# Altium schematic sheet COMMOM.SchDoc
size A4; SheetNumber: 3; SheetTotal: 3
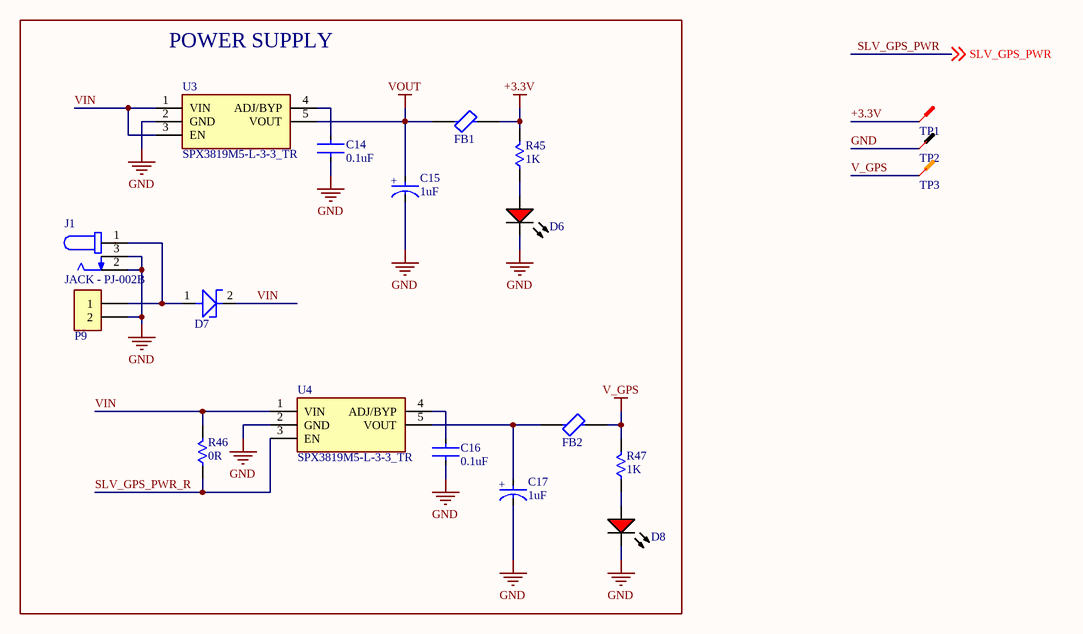
[diagram p0: COMMOM.SchDoc]

## Parts
C14  0.1uF  [0805-CAP]
C15  1uF  [1206-CAP-TANT]
C16  0.1uF  [0805-CAP]
C17  1uF  [1206-CAP-TANT]
D6  RED  [0805-LED-RED]  (value not drawn)
D7  NRVB120VLSFT1G  [SOD-123]  (value not drawn)
D8  RED  [0805-LED-RED]  (value not drawn)
FB1  BLM21BB121SN1D  [0805-IND]  (value not drawn)
FB2  BLM21BB121SN1D  [0805-IND]  (value not drawn)
J1  JACK - PJ-002B  [JACK - CUI_PJ-002B]
P9  691312510002  [691312510002]  (value not drawn)
R45  1K  [0805-RES]
R46  0R  [0805-RES]
R47  1K  [0805-RES]
TP1  .Net  [TESTPOINT_MINI_RED]  (value not drawn)
TP2  .Net  [TESTPOINT_MINI_BLACK]  (value not drawn)
TP3  5003  [TESTPOINT_MINI_ORANGE]  (value not drawn)
U3  SPX3819M5-L-3-3_TR  [SPX3819M5-L-3-3_TR]
U4  SPX3819M5-L-3-3_TR  [SPX3819M5-L-3-3_TR]

## Blocks framed on the sheet
POWER SUPPLY: C14-C17 D6-D8 FB1 FB2 J1 P9 R45-R47 U3 U4

## Nets
+3.3V: FB1.2 R45.2 TP1.1
GND: C14.2 C15.2(C) C16.2 C17.2(C) D6.2(K) D8.2(K) J1.2 J1.3 P9.2 TP2.1 U3.2(GND) U4.2(GND)
V_GPS: FB2.2 R47.2 TP3.1
VOUT: C15.1(A) FB1.1 U3.5(VOUT)
SLV_GPS_PWR_R: R46.1 U4.3(EN)
VIN: D7.2 R46.2 U3.1(VIN) U3.3(EN) U4.1(VIN)
NetC14_1: C14.1 U3.4(ADJ/BYP)
NetC16_1: C16.1 U4.4(ADJ/BYP)
NetC17_1: C17.1(A) FB2.1 U4.5(VOUT)
NetD6_1: D6.1(A) R45.1
NetD7_1: D7.1 J1.1 P9.1
NetD8_1: D8.1(A) R47.1

## Notes on the sheet
- Title:
- Author:
- Sheet:
- Date:
- Revision:
- /
- (in symbol TAJA105K020RNJ) +

## Library data of the parts
C14 C16 = AC0805KRX7R7BB104: CAP CER SMD 0805, 0.1uF / 16V, ±10%; Manufacturer: Yageo; Value: 100nF; Supplier 1: Mouser; Manufacturer Part Number: AC0805KRX7R7BB104; RoHS: Yes; Category: Ceramic Capacitors; Stock 1: 118257; Pricing 1: 1=0,19, 10=0,079, 50=0,079, 100=0,046, 1000=0,041, 10000=0,028 (USD); Case/Package: 0805; Case Code (Imperial): 0805; Case Code (Metric): 2012; Min Operating Temperature: -55°C; Max Operating Temperature: 125°C; Tolerance: 10%; Voltage Rating: 16V; Packaging: Cut Tape; Series: AC; Ratings: AEC-Q200; RoHS Compliant: Yes; ComponentLink1URL: http://www.yageo.com/NewPortal/_en/search/productDocs.jsp?YageoPartNumber=AC0805KRX7R7BB104&src-supplier=Digi-Key; ComponentLink1Description: http://www.yageo.com/NewPortal/_en/search/productDocs.jsp?YageoPartNumber=AC0805KRX7R7BB104&src-supplier=Digi-Key; Supplier Part Number 1: 603-AC805KRX7R7BB104; Mounting Technology: Surface Mount; Supplier 2: Digi-Key; Supplier 3: Digi-Key; Supplier Part Number 2: 311-3162-1-ND; Supplier Part Number 3: 311-3162-6-ND
C15 C17 = TAJA105K020RNJ: CAP TANT SMD 1206, 1uF / 20V, ±10%; Manufacturer: Kyocera AVX; Dielectric Material: Tantalum; Tolerance: 20%; ESR (Equivalent Series Resistance): 9R; Leakage Current: 500nA; Polarity: Polar; Dissipation Factor: 4%; Supplier 1: Mouser; Manufacturer Part Number: TAJA105K020RNJ; RoHS: Yes; Category: Tantalum Capacitors; Stock 1: 2000; Pricing 1: 2000=0,09520 (USD); Mount: Surface Mount,PCB; Case/Package: 1206; Number of Pins: 2; Case Code (Imperial): 1206; Case Code (Metric): 3216; Min Operating Temperature: -55°C; Max Operating Temperature: 125°C; Capacitance: 1uF; Voltage Rating: 20V; Voltage Rating (DC): 20V; Package Quantity: 1; Packaging: Tape and Reel; Termination: SMD/SMT; Voltage: 20V; Features: General Purpose; Series: TAJ; Construction: Flat; Length: 3.2mm; Width: 1.6mm; Height: 1.6mm; Height - Seated (Max): 0.071inch; Depth: 1.6mm; Radiation Hardening: No; REACH SVHC: No SVHC; Lead Free: Lead Free; RoHS Compliant: Yes; ComponentLink1URL: https://datasheet.ciiva.com/11794/0900766b80ccdc61-11794382.pdf?src-supplier=RSComponents; ComponentLink1Description: https://datasheet.ciiva.com/11794/0900766b80ccdc61-11794382.pdf?src-supplier=RSComponents; ComponentLink2URL: https://datasheet.ciiva.com/12883/taj-27497-12883280.pdf?src-supplier=Mouser; ComponentLink2Description: https://datasheet.ciiva.com/12883/taj-27497-12883280.pdf?src-supplier=Mouser; ComponentLink3URL: https://datasheet.ciiva.com/263/taj-263413.pdf?src-supplier=Digi-Key; ComponentLink3Description: https://datasheet.ciiva.com/263/taj-263413.pdf?src-supplier=Digi-Key; ComponentLink4URL: https://datasheet.ciiva.com/263/taj-263412.pdf?src-supplier=Digi-Key; ComponentLink4Description: https://datasheet.ciiva.com/263/taj-263412.pdf?src-supplier=Digi-Key; ComponentLink5URL: https://datasheet.ciiva.com/263/taj-263414.pdf?src-supplier=Digi-Key; ComponentLink5Description: https://datasheet.ciiva.com/263/taj-263414.pdf?src-supplier=Digi-Key; ComponentLink6URL: https://datasheet.ciiva.com/14608/70001050-14608053.pdf?src-supplier=Allied+Electronics; ComponentLink6Description: https://datasheet.ciiva.com/14608/70001050-14608053.pdf?src-supplier=Allied+Electronics; ComponentLink7URL: https://datasheet.ciiva.com/14598/70001050-14598921.pdf?src-supplier=Allied+Electronics; ComponentLink7Description: https://datasheet.ciiva.com/14598/70001050-14598921.pdf?src-supplier=Allied+Electronics; ComponentLink8URL: https://datasheet.ciiva.com/3004/taj-3004373.pdf?src-supplier=Avnet; ComponentLink8Description: https://datasheet.ciiva.com/3004/taj-3004373.pdf?src-supplier=Avnet; ComponentLink9URL: https://datasheet.ciiva.com/16203/taj-16203563.pdf?src-supplier=Future+Electronics; ComponentLink9Description: https://datasheet.ciiva.com/16203/taj-16203563.pdf?src-supplier=Future+Electronics; ComponentLink10URL: https://datasheet.ciiva.com/3004/taj-3004372.pdf?src-supplier=Avnet; ComponentLink10Description: https://datasheet.ciiva.com/3004/taj-3004372.pdf?src-supplier=Avnet; Supplier Part Number 1: 581-TAJA105K020; Supplier 2: Digi-Key; Supplier Part Number 2: 478-1650-1-ND; Supplier 3: Digi-Key; Supplier Part Number 3: 478-1650-6-ND
D6 D8 = LTST-C170EKT: LED RED, SMD 0805, 2V/30mA; Manufacturer: Vishay Lite-On; Lens Color: Colorless; Power Rating: 100mW; Luminous Intensity: 2mcd; Viewing Angle: 130°; Forward Voltage: 2V; Lens Style: Flat,Diffused,Colorless,Rectangular,Clear; Forward Current: 30mA; Dominant Wavelength: 621nm; Test Current: 10mA; Lens Transparency: Clear; Number of Elements: 1; Wavelength: 630nm; Reverse Voltage: 5V; Lens Size: 1.25mm; Supplier 1: Mouser; Manufacturer Part Number: LTST-C170EKT; RoHS: Yes; Category: LEDs; Stock 1: 36000; Pricing 1: 3000=0,0571, 6000=0,0465, 15000=0,0404, 30000=0,035, 75000=0,0347, 150000=0,0331 (USD); Case/Package: 0805; Color: Red; Case Code (Metric): 2012; Case Code (Imperial): 0805; Min Operating Temperature: -55°C; Max Operating Temperature: 85°C; Packaging: Tape and Reel; Package Quantity: 3000; Illumination Color: Red; Power Dissipation: 100mW; Number of LEDs: 1; Length: 2mm; Width: 1.25mm; Height: 1.1mm; Depth: 1.25mm; Radiation Hardening: No; Lead Free: Lead Free; RoHS Compliant: Yes; ComponentLink1URL: https://datasheet.ciiva.com/16202/lite-on20ltst-c170ekt-16202383.pdf?src-supplier=Future+Electronics; ComponentLink1Description: https://datasheet.ciiva.com/16202/lite-on20ltst-c170ekt-16202383.pdf?src-supplier=Future+Electronics; ComponentLink2URL: https://datasheet.ciiva.com/2110/ltst-c170ekt-2110099.pdf?src-supplier=Digi-Key; ComponentLink2Description: https://datasheet.ciiva.com/2110/ltst-c170ekt-2110099.pdf?src-supplier=Digi-Key; ComponentLink3URL: https://datasheet.ciiva.com/11775/0900766b80dc0277-11775641.pdf?src-supplier=Rs; ComponentLink3Description: https://datasheet.ciiva.com/11775/0900766b80dc0277-11775641.pdf?src-supplier=Rs; ComponentLink4URL: https://datasheet.ciiva.com/19482/1260314-19482330.pdf?src-supplier=Jameco; ComponentLink4Description: https://datasheet.ciiva.com/19482/1260314-19482330.pdf?src-supplier=Jameco; ComponentLink5URL: https://datasheet.ciiva.com/15117/getdatasheetpartid-147507-15117859.pdf?src-supplier=Verical; ComponentLink5Description: https://datasheet.ciiva.com/15117/getdatasheetpartid-147507-15117859.pdf?src-supplier=Verical; ComponentLink6URL: https://datasheet.ciiva.com/2110/ltst-c170ekt-2110100.pdf?src-supplier=Digi-Key; ComponentLink6Description: https://datasheet.ciiva.com/2110/ltst-c170ekt-2110100.pdf?src-supplier=Digi-Key; ComponentLink7URL: https://datasheet.ciiva.com/2110/ltst-c170ekt-2110101.pdf?src-supplier=Digi-Key; ComponentLink7Description: https://datasheet.ciiva.com/2110/ltst-c170ekt-2110101.pdf?src-supplier=Digi-Key; Supplier Part Number 1: 859-LTST-C170EKT; Mounting Technology: Surface Mount; Pins: 2; Series: -; Voltage: 5V; Supplier 2: Digi-Key; Supplier Part Number 2: 160-1178-1-ND; Supplier 3: Digi-Key; Supplier Part Number 3: 160-1178-6-ND
D7 = NRVB120VLSFT1G: DIODE SHOTTKY SMD SOD-123F, 0,3V/1A, VBR 20V; Manufacturer: ON Semiconductor; Average Rectified Current: 1A; Max Reverse Current: 15mA; Peak Non-Repetitive Surge Current: 45A; Element Configuration: Single; Supplier 2: Digi-Key; Manufacturer Part Number: NRVB120VLSFT1G; RoHS: Yes; Category: Schottky Diodes; Stock 1: 170; Pricing 1: 1=0,51000, 5=0,51000, 10=0,43400, 25=0,39700, 50=0,36100, 100=0,32400, 250=0,28900, 500=0,25400, 1000=0,19700 (USD); Mount: Surface Mount; Case/Package: SOD; Number of Pins: 2; Min Operating Temperature: -65°C; Max Operating Temperature: 125°C; Packaging: Tape and Reel; Max Repetitive Reverse Voltage (Vrrm): 20V; Max Reverse Voltage (DC): 20V; Lead Free: Lead Free; RoHS Compliant: Yes; ComponentLink1URL: http://www.farnell.com/datasheets/2028665.pdf?src-supplier=Farnell; ComponentLink1Description: http://www.farnell.com/datasheets/2028665.pdf?src-supplier=Farnell; ComponentLink2URL: http://www.mouser.com/ds/2/308/MBR120VLSFT1-D-1074021.pdf?src-supplier=Mouser; ComponentLink2Description: http://www.mouser.com/ds/2/308/MBR120VLSFT1-D-1074021.pdf?src-supplier=Mouser; ComponentLink3URL: http://www.onsemi.com/pub/Collateral/MBR120VLSFT1-D.PDF?src-supplier=Digi-Key; ComponentLink3Description: http://www.onsemi.com/pub/Collateral/MBR120VLSFT1-D.PDF?src-supplier=Digi-Key; ComponentLink4URL: http://www.onsemi.com/pub/Collateral/MBR120VLSFT1-D.PDF?src-supplier=Avnet; ComponentLink4Description: http://www.onsemi.com/pub/Collateral/MBR120VLSFT1-D.PDF?src-supplier=Avnet; ComponentLink5URL: http://www.farnell.com/datasheets/2028665.pdf?src-supplier=Element14; ComponentLink5Description: http://www.farnell.com/datasheets/2028665.pdf?src-supplier=Element14; ComponentLink6URL: http://www.farnell.com/datasheets/2028665.pdf?src-supplier=Newark; ComponentLink6Description: http://www.farnell.com/datasheets/2028665.pdf?src-supplier=Newark; Supplier Part Number 2: NRVB120VLSFT1GOSCT-ND; Supplier 1: Mouser; Supplier Part Number 1: 863-NRVB120VLSFT1G; Supplier 3: Digi-Key; Supplier Part Number 3: NRVB120VLSFT1GOSDKR-ND
FB1 FB2 = BLM21BB121SN1D: FERRITE BEAD SMD 0805, 120Ω/100MHz, DC_RES=0.19Ω, 600mA; Manufacturer: Murata; Material: Steel,Ferrite; Impedance: 120R; Tolerance: 25%; Max DC Current: 200mA; DC Resistance (DCR): 190mR; Test Frequency: 100MHz; Number of Lines: 1; Shielding: Unshielded; DC Resistance-Max: 250mR; Supplier 1: Mouser; Manufacturer Part Number: BLM21BB121SN1D; RoHS: Yes; Category: Ferrite Beads and Chips; Stock 1: 377; Pricing 1: 1=0,15, 10=0,1, 50=0,1, 100=0,069, 1000=0,042, 10000=0,037 (USD); Case/Package: 0805; Core Material: Ferrite; Case Code (Metric): 2012; Case Code (Imperial): 0805; Min Operating Temperature: -55°C; Max Operating Temperature: 125°C; Package Quantity: 1; Packaging: Tape and Reel; Current Rating: 600mA; Max Current Rating: 600mA; Termination: SMD/SMT; Frequency: 100MHz; Number of Circuits: 1; Length: 2mm; Width: 1.25mm; Height: 0.85mm; Depth: 1.45mm; Lead Free: Lead Free; RoHS Compliant: Yes; ComponentLink1URL: https://datasheet.ciiva.com/11800/0900766b81275df9-11800837.pdf?src-supplier=Rs; ComponentLink1Description: https://datasheet.ciiva.com/11800/0900766b81275df9-11800837.pdf?src-supplier=Rs; ComponentLink2URL: https://datasheet.ciiva.com/41449/001172337-da-01-en-drossel-0805-120r-2-0x1-25mm-4000st-41449654.pdf?src-supplier=Conrad; ComponentLink2Description: https://datasheet.ciiva.com/41449/001172337-da-01-en-drossel-0805-120r-2-0x1-25mm-4000st-41449654.pdf?src-supplier=Conrad; ComponentLink3URL: https://datasheet.ciiva.com/16420/l0110s0100blm21b-16420733.pdf?src-supplier=Future+Electronics; ComponentLink3Description: https://datasheet.ciiva.com/16420/l0110s0100blm21b-16420733.pdf?src-supplier=Future+Electronics; ComponentLink4URL: https://datasheet.ciiva.com/8021/5159-8021526.pdf?src-supplier=Element14; ComponentLink4Description: https://datasheet.ciiva.com/8021/5159-8021526.pdf?src-supplier=Element14; ComponentLink5URL: https://datasheet.ciiva.com/1012/l0110s0100blm21b-1012662.pdf?src-supplier=Digi-Key; ComponentLink5Description: https://datasheet.ciiva.com/1012/l0110s0100blm21b-1012662.pdf?src-supplier=Digi-Key; ComponentLink6URL: https://datasheet.ciiva.com/1012/l0110s0100blm21b-1012663.pdf?src-supplier=Digi-Key; ComponentLink6Description: https://datasheet.ciiva.com/1012/l0110s0100blm21b-1012663.pdf?src-supplier=Digi-Key; ComponentLink7URL: https://datasheet.ciiva.com/1012/l0110s0100blm21b-1012664.pdf?src-supplier=Digi-Key; ComponentLink7Description: https://datasheet.ciiva.com/1012/l0110s0100blm21b-1012664.pdf?src-supplier=Digi-Key; ComponentLink8URL: https://datasheet.ciiva.com/3082/l0110s0100blm21b-3082737.pdf?src-supplier=Avnet; ComponentLink8Description: https://datasheet.ciiva.com/3082/l0110s0100blm21b-3082737.pdf?src-supplier=Avnet; Supplier Part Number 1: 81-BLM21B121S; Pins: 2; Series: BLM21B; Reach SVHC Compliant: No; Weight: 0.000194oz; Supplier 2: Digi-Key; Supplier 3: Digi-Key; Supplier Part Number 2: 490-1042-6-ND; Supplier Part Number 3: 490-1042-1-ND
J1 = JACK - PJ-002B: CONN PWR JACK 2.5X5.5MM SOLDER; Manufacturer: CUI; Gender: Male; Shielding: Unshielded; Current Rating: 2.5A; Voltage Rating: 24V; Insulation Resistance: 100MR; Number of Conductors: 2; Supplier 1: Digi-Key; Manufacturer Part Number: PJ-002B; RoHS: Yes; Category: Connectors; Mount: Through Hole; Contact Plating: Nickel; Color: Black; Housing Color: Black; Housing Material: Thermoplastic; Contact Material: Copper,Copper Alloy; Min Operating Temperature: -25°C; Max Operating Temperature: 85°C; Series: -; Packaging: Bulk; Package Quantity: 500; Termination: Through Hole; Connector Type: Jack; Orientation: Horizontal; Contact Gender: Male; Diameter: 2.5mm; Lead Free: Lead Free; Flammability Rating: UL94 V-0; ComponentLink1URL: http://www.mouser.com/ds/2/670/pj-002b-515833.pdf?src-supplier=Mouser; ComponentLink1Description: http://www.mouser.com/ds/2/670/pj-002b-515833.pdf?src-supplier=Mouser; ComponentLink2URL: https://www.cui.com/product/resource/digikeypdf/pj-002b.pdf?src-supplier=Digi-Key; ComponentLink2Description: https://www.cui.com/product/resource/digikeypdf/pj-002b.pdf?src-supplier=Digi-Key; ComponentLink3URL: http://www.cui.com/Product/Resource/FuturePDF/PJ-002B.pdf?src-supplier=Future+Electronics; ComponentLink3Description: http://www.cui.com/Product/Resource/FuturePDF/PJ-002B.pdf?src-supplier=Future+Electronics; Supplier Part Number 1: CP-002B-ND
P9 = 691312510002: 312; 5.08mm Pitch Straight Pluggable Term Block; PCB Header; Through Hole; 2 Way; Manufacturer: Wurth Electronics; Number of Positions Per Level: 2; Number of Levels: 1; Current: 20A; Voltage: 300V; Supplier 1: Mouser; Manufacturer Part Number: 691312510002; RoHS: Yes; Category: Terminal Blocks; Stock 1: 3027; Pricing 1: 1=0,35, 10=0,333, 50=0,316, 100=0,316, 1000=0,312, 10000=0,308 (USD); Mounting Technology: Through Hole; Color: Green; Contact Material: Brass; Housing Material: PBT; Contact Plating: Tin; Number of Rows: 1; Termination: Solder; Number of Contacts: 2; Series: WR-TBL Series 312; Number of Positions: 2; Length: 11.5mm; Width: 10.16mm; Height: 12mm; Pitch: 5.08mm; RoHS Compliant: Yes; Flammability Rating: UL94 V-0; Reach SVHC Compliant: Unknown; ComponentLink1URL: https://datasheet.ciiva.com/48692/001088667-da-01-en-wr-tbl-terminal-block312-691312510002-48692923.pdf?src-supplier=Conrad; ComponentLink1Description: https://datasheet.ciiva.com/48692/001088667-da-01-en-wr-tbl-terminal-block312-691312510002-48692923.pdf?src-supplier=Conrad; Supplier Part Number 1: 710-691312510002; Supplier 2: Digi-Key; Supplier Part Number 2: 732-2064-ND
R45 R47 = RNCP0805FTD1K00: Res Thin Film 0805 1K Ohm 1% 0.25W(1/4W) ±100ppm/C Sulfur Resistant Pad SMD T/R; Manufacturer: Stackpole Electronics; Temperature Coefficient: 100ppm/°C; Value: 1kR; Power Rating: 250mW; Supplier 1: Mouser; Manufacturer Part Number: RNCP0805FTD1K00; RoHS: Yes; Category: Chip SMD Resistors; Stock 1: 70653; Pricing 1: 1=0,1, 10=0,069, 50=0,069, 100=0,029, 1000=0,013, 10000=0,007 (USD); Packaging: Cut Tape; Features: Moisture Resistant,Anti-Sulfur; ComponentLink1URL: http://www.seielect.com/Catalog/SEI-rncp.pdf?src-supplier=Future+Electronics; ComponentLink1Description: http://www.seielect.com/Catalog/SEI-rncp.pdf?src-supplier=Future+Electronics; Supplier Part Number 1: 708-RNCP0805FTD1K00; Tolerance: 1%; Mounting Technology: Surface Mount; Case/Package: 0805; Case Code (Metric): 2012; Case Code (Imperial): 0805; Min Operating Temperature: -55°C; Max Operating Temperature: 155°C; Number of Terminations: 2; Max Power Dissipation: 250mW; Series: RNCP; Length: 0.079inch; Width: 0.049inch; Height: 0.024inch; Lead Free: Lead Free; RoHS Compliant: Yes; ComponentLink2URL: https://www.seielect.com/catalog/SEI-Packaging.pdf?src-supplier=Digi-Key; ComponentLink2Description: https://www.seielect.com/catalog/SEI-Packaging.pdf?src-supplier=Digi-Key; ComponentLink3URL: https://www.seielect.com/Catalog/SEI-rncp.pdf?src-supplier=Digi-Key; ComponentLink3Description: https://www.seielect.com/Catalog/SEI-rncp.pdf?src-supplier=Digi-Key; Supplier 2: Digi-Key; Supplier 3: Digi-Key; Supplier Part Number 2: RNCP0805FTD1K00CT-ND; Supplier Part Number 3: RNCP0805FTD1K00DKR-ND
R46 = RC0805JR-070RL: RES SMD 0805, 0 OHM JUMPER 1/8W; Manufacturer 1: Yageo; Tolerance: 5%; Temperature Coefficient: 200ppm/°C; Description 1: YAGEO         RC0805JR-070RL             RES, THICK FILM, 0R, 0.125W, 0805; Resistance: 0mR; Power Rating: 125mW; Voltage Rating: 150V; Supplier 1: Mouser; Stock 1: 18575448; Pricing 1: 1=0.1, 10=0.037, 25=0.0272, 50=0.0206, 100=0.0153, 250=0.01164, 500=0.0093, 1000=0.00685 (USD); Packaging: Tape and Reel; Composition: Thick Film; ComponentLink1URL: http://www.farnell.com/datasheets/1738694.pdf; ComponentLink1Description: http://www.farnell.com/datasheets/1738694.pdf; Supplier Part Number 1: 603-RC0805JR-070RL; Supplier 2: Digi-Key; Supplier Part Number 2: 311-0.0ARCT-ND; Case/Package: 0805; Number of Pins: 2; Contact Plating: Matte,Tin; Case Code (Imperial): 0805; Case Code (Metric): 2012; Min Operating Temperature: -55°C; Max Operating Temperature: 155°C; Voltage Rating (DC): 150V; Termination: SMD/SMT; Military Standard: Not; Length: 2mm; Height: 0.5mm; Width: 1.25mm; Depth: 1.25mm; Radiation Hardening: No; REACH SVHC: Unknown; Lead Free: Lead Free; ComponentLink2URL: http://documents.rs-components.com/techlib://itc_doclist_GB.htm?stockno=6185129; ComponentLink2Description: http://documents.rs-components.com/techlib://itc_doclist_GB.htm?stockno=6185129; ComponentLink3URL: https://www.verical.com/server-webapp/html/getDatasheet?partID=330685; ComponentLink3Description: https://www.verical.com/server-webapp/html/getDatasheet?partID=330685; Manufacturer Part Number: RC0805JR-070RL; Supplier 3: Digi-Key; Supplier Part Number 3: 311-0.0ARDKR-ND
TP1 = TESTPOINT 5000: PC TEST POINT MINIATURE RED; Manufacturer 1: Keystone Electronics; Manufacturer Part Number 1: 5000; Body Material: PBT,Bronze; Plating: Silver; Number of Contacts: 1; Insulation: Insulated; Outside Diameter: 2.54mm; Inside Diameter: 1.27mm; Hole Diameter: 1.6mm; Supplier 1: Digi-Key; Stock 1: 386862; Pricing 1: 1=0,35000, 25=0,30800, 100=0,30150, 250=0,28304, 500=0,25230, 1000=0,17140, 2500=0,15296, 5000=0,14340, 10000=0,13384 (USD); RoHS: Yes; Mount: Through Hole,PCB; Color: Red; Contact Material: Bronze; Material: Nylon,Bronze,Silver; Contact Plating: Silver,Tin; Housing Color: Red; Package Quantity: 100; Packaging: Bulk; Orientation: Straight; Number of Ports: 1; Length: 7.62mm; Height: 0.3inch; Lead Free: Lead Free; REACH SVHC: No SVHC; Flammability Rating: UL94 V-0; ComponentLink1URL: https://datasheet.ciiva.com/11836/0900766b8009b7c7-11836046.pdf?src-supplier=RSComponents; ComponentLink1Description: https://datasheet.ciiva.com/11836/0900766b8009b7c7-11836046.pdf?src-supplier=RSComponents; ComponentLink2URL: https://datasheet.ciiva.com/2917/5000-5004-2917627.pdf?src-supplier=Digi-Key; ComponentLink2Description: https://datasheet.ciiva.com/2917/5000-5004-2917627.pdf?src-supplier=Digi-Key; ComponentLink3URL: https://datasheet.ciiva.com/16883/70182825-16883965.pdf?src-supplier=Allied+Electronics; ComponentLink3Description: https://datasheet.ciiva.com/16883/70182825-16883965.pdf?src-supplier=Allied+Electronics; Supplier Part Number 1: 36-5000-ND
TP2 = TESTPOINT 5001: PC TEST POINT MINIATURE BLACK; Manufacturer 1: Keystone Electronics; Manufacturer Part Number 1: 5001; Plating: Silver; Body Material: PBT,Bronze; Number of Ports: 1; Insulation: Insulated; Inside Diameter: 1.27mm; Hole Diameter: 1.6mm; Outside Diameter: 2.54mm; Supplier 1: Digi-Key; Stock 1: 483919; Pricing 1: 1=0,35000, 25=0,30800, 100=0,30150, 250=0,28304, 500=0,25230, 1000=0,17140, 2500=0,15296, 5000=0,14340, 10000=0,13384 (USD); RoHS: Yes; Mount: Through Hole,PCB; Color: Black; Contact Material: Bronze; Material: Nylon,Bronze,Silver; Contact Plating: Silver,Tin; Housing Color: Black; Packaging: Bulk; Package Quantity: 100; Termination: Through Hole; Number of Contacts: 1; Orientation: Straight; Diameter: 2.54mm; Length: 7.62mm; Height: 0.3inch; Lead Free: Lead Free; REACH SVHC: No SVHC; Flammability Rating: UL94 V-0; ComponentLink1URL: https://datasheet.ciiva.com/27052/1581986-27052611.pdf?src-supplier=Jameco; ComponentLink1Description: https://datasheet.ciiva.com/27052/1581986-27052611.pdf?src-supplier=Jameco; ComponentLink2URL: https://datasheet.ciiva.com/11836/0900766b8009b7c7-11836045.pdf?src-supplier=RSComponents; ComponentLink2Description: https://datasheet.ciiva.com/11836/0900766b8009b7c7-11836045.pdf?src-supplier=RSComponents; ComponentLink3URL: https://datasheet.ciiva.com/16318/m60-2p60-16318423.pdf?src-supplier=Future+Electronics; ComponentLink3Description: https://datasheet.ciiva.com/16318/m60-2p60-16318423.pdf?src-supplier=Future+Electronics; ComponentLink4URL: https://datasheet.ciiva.com/22631/1703983-22631100.pdf?src-supplier=Element14; ComponentLink4Description: https://datasheet.ciiva.com/22631/1703983-22631100.pdf?src-supplier=Element14; Supplier Part Number 1: 36-5001-ND
TP3 = TESTPOINT 5003: PC TEST POINT MINIATURE ORANGE; Manufacturer 1: Keystone Electronics; Plating: Silver; Body Material: PBT; Outside Diameter: 2.54mm; Inside Diameter: 1.27mm; Supplier 1: Digi-Key; Manufacturer Part Number 1: 5003; RoHS: Yes; Category: Connectors; Stock 1: 86359; Pricing 1: 1=0,42000, 25=0,34080, 100=0,30150, 250=0,28304, 500=0,25230, 1000=0,19884, 2500=0,18180, 5000=0,17044 (USD); Mount: PCB,Through Hole; Number of Pins: 1; Color: Orange,White; Contact Material: Bronze; Contact Plating: Silver,Tin; Material: Nylon,Bronze,Silver; Packaging: Bulk; Series: THM; Package Quantity: 10; Termination: Through Hole; Length: 7.62mm; Height: 0.3inch; Lead Free: Lead Free; REACH SVHC: No SVHC; RoHS Compliant: Yes; Flammability Rating: UL94 V-0; ComponentLink1URL: https://datasheet.ciiva.com/1454/1703983-1454826.pdf?src-supplier=Element14; ComponentLink1Description: https://datasheet.ciiva.com/1454/1703983-1454826.pdf?src-supplier=Element14; ComponentLink2URL: https://datasheet.ciiva.com/22631/1703983-22631103.pdf?src-supplier=Element14; ComponentLink2Description: https://datasheet.ciiva.com/22631/1703983-22631103.pdf?src-supplier=Element14; ComponentLink3URL: https://datasheet.ciiva.com/4598/5000-5004-4598618.pdf?src-supplier=Mouser; ComponentLink3Description: https://datasheet.ciiva.com/4598/5000-5004-4598618.pdf?src-supplier=Mouser; ComponentLink4URL: https://datasheet.ciiva.com/16885/70182825-16885788.pdf?src-supplier=Allied+Electronics; ComponentLink4Description: https://datasheet.ciiva.com/16885/70182825-16885788.pdf?src-supplier=Allied+Electronics; Supplier Part Number 1: 36-5003-ND
U3 = SPX3819M5-L-3-3_TR: IC REG LDO 3.3V 0.5A SOT23-5; Manufacturer Part Number: SPX3819M5-L-3-3/TR; Manufacturer: Exar; Output Current: 500mA; Max Supply Voltage: 16V; Number of Regulators: 1; Quiescent Current: 3uA; Output Type: Fixed; Dropout Voltage: 340mV; Min Input Voltage: 2.5V; Max Output current: 100mA; Polarity: Positive; Accuracy: 1%; Supplier 2: Digi-Key; RoHS: Yes; Category: Voltage Regulators - Linear; Stock 1: 360; Pricing 1: 50=0,362, 100=0,352, 250=0,308, 500=0,261 (GBP); Mounting Technology: Surface Mount; Case/Package: SOT-23-5; Pins: 5; Min Operating Temperature: -40°C; Max Operating Temperature: 125°C; Packaging: Tape and Reel; Min Output Voltage: 3.3V; Number of Outputs: 1; Output Voltage: 3.3V; Length: 2.9mm; Width: 1.6mm; Height: 1.3mm; Radiation Hardening: No; RoHS Compliant: Yes; Lead Free: Lead Free; ComponentLink1URL: https://datasheet.ciiva.com/6594/spx3819-ds-r202-052014-6594086.pdf?src-supplier=Digi-Key; ComponentLink1Description: https://datasheet.ciiva.com/6594/spx3819-ds-r202-052014-6594086.pdf?src-supplier=Digi-Key; ComponentLink2URL: https://datasheet.ciiva.com/16291/spx3819-series-16291548.pdf?src-supplier=Future+Electronics; ComponentLink2Description: https://datasheet.ciiva.com/16291/spx3819-series-16291548.pdf?src-supplier=Future+Electronics; Supplier Part Number 2: 1016-1873-1-ND; Supplier 1: Mouser; Supplier Part Number 1: 701-SPX3819M5-L-33TR; Supplier 3: Digi-Key; Supplier Part Number 3: 1016-1873--ND
U4 = SPX3819M5-L-3-3_TR: IC REG LDO 3.3V 0.5A SOT23-5; Manufacturer: Exar; Manufacturer Part Number: SPX3819M5-L-3-3/TR; Output Current: 500mA; Max Supply Voltage: 16V; Number of Regulators: 1; Quiescent Current: 3uA; Output Type: Fixed; Dropout Voltage: 340mV; Min Input Voltage: 2.5V; Max Output current: 100mA; Polarity: Positive; Accuracy: 1%; Supplier 2: Digi-Key; RoHS: Yes; Category: Voltage Regulators - Linear; Stock 1: 360; Pricing 1: 50=0,362, 100=0,352, 250=0,308, 500=0,261 (GBP); Mounting Technology: Surface Mount; Case/Package: SOT-23-5; Pins: 5; Min Operating Temperature: -40°C; Max Operating Temperature: 125°C; Packaging: Tape and Reel; Min Output Voltage: 3.3V; Number of Outputs: 1; Output Voltage: 3.3V; Length: 2.9mm; Width: 1.6mm; Height: 1.3mm; Radiation Hardening: No; RoHS Compliant: Yes; Lead Free: Lead Free; ComponentLink1URL: https://datasheet.ciiva.com/6594/spx3819-ds-r202-052014-6594086.pdf?src-supplier=Digi-Key; ComponentLink1Description: https://datasheet.ciiva.com/6594/spx3819-ds-r202-052014-6594086.pdf?src-supplier=Digi-Key; ComponentLink2URL: https://datasheet.ciiva.com/16291/spx3819-series-16291548.pdf?src-supplier=Future+Electronics; ComponentLink2Description: https://datasheet.ciiva.com/16291/spx3819-series-16291548.pdf?src-supplier=Future+Electronics; Supplier Part Number 2: 1016-1873-1-ND; Supplier 1: Mouser; Supplier Part Number 1: 701-SPX3819M5-L-33TR; Supplier 3: Digi-Key; Supplier Part Number 3: 1016-1873--ND